# EAGLE design VCLFO_th (EAGLE 7.5.0)
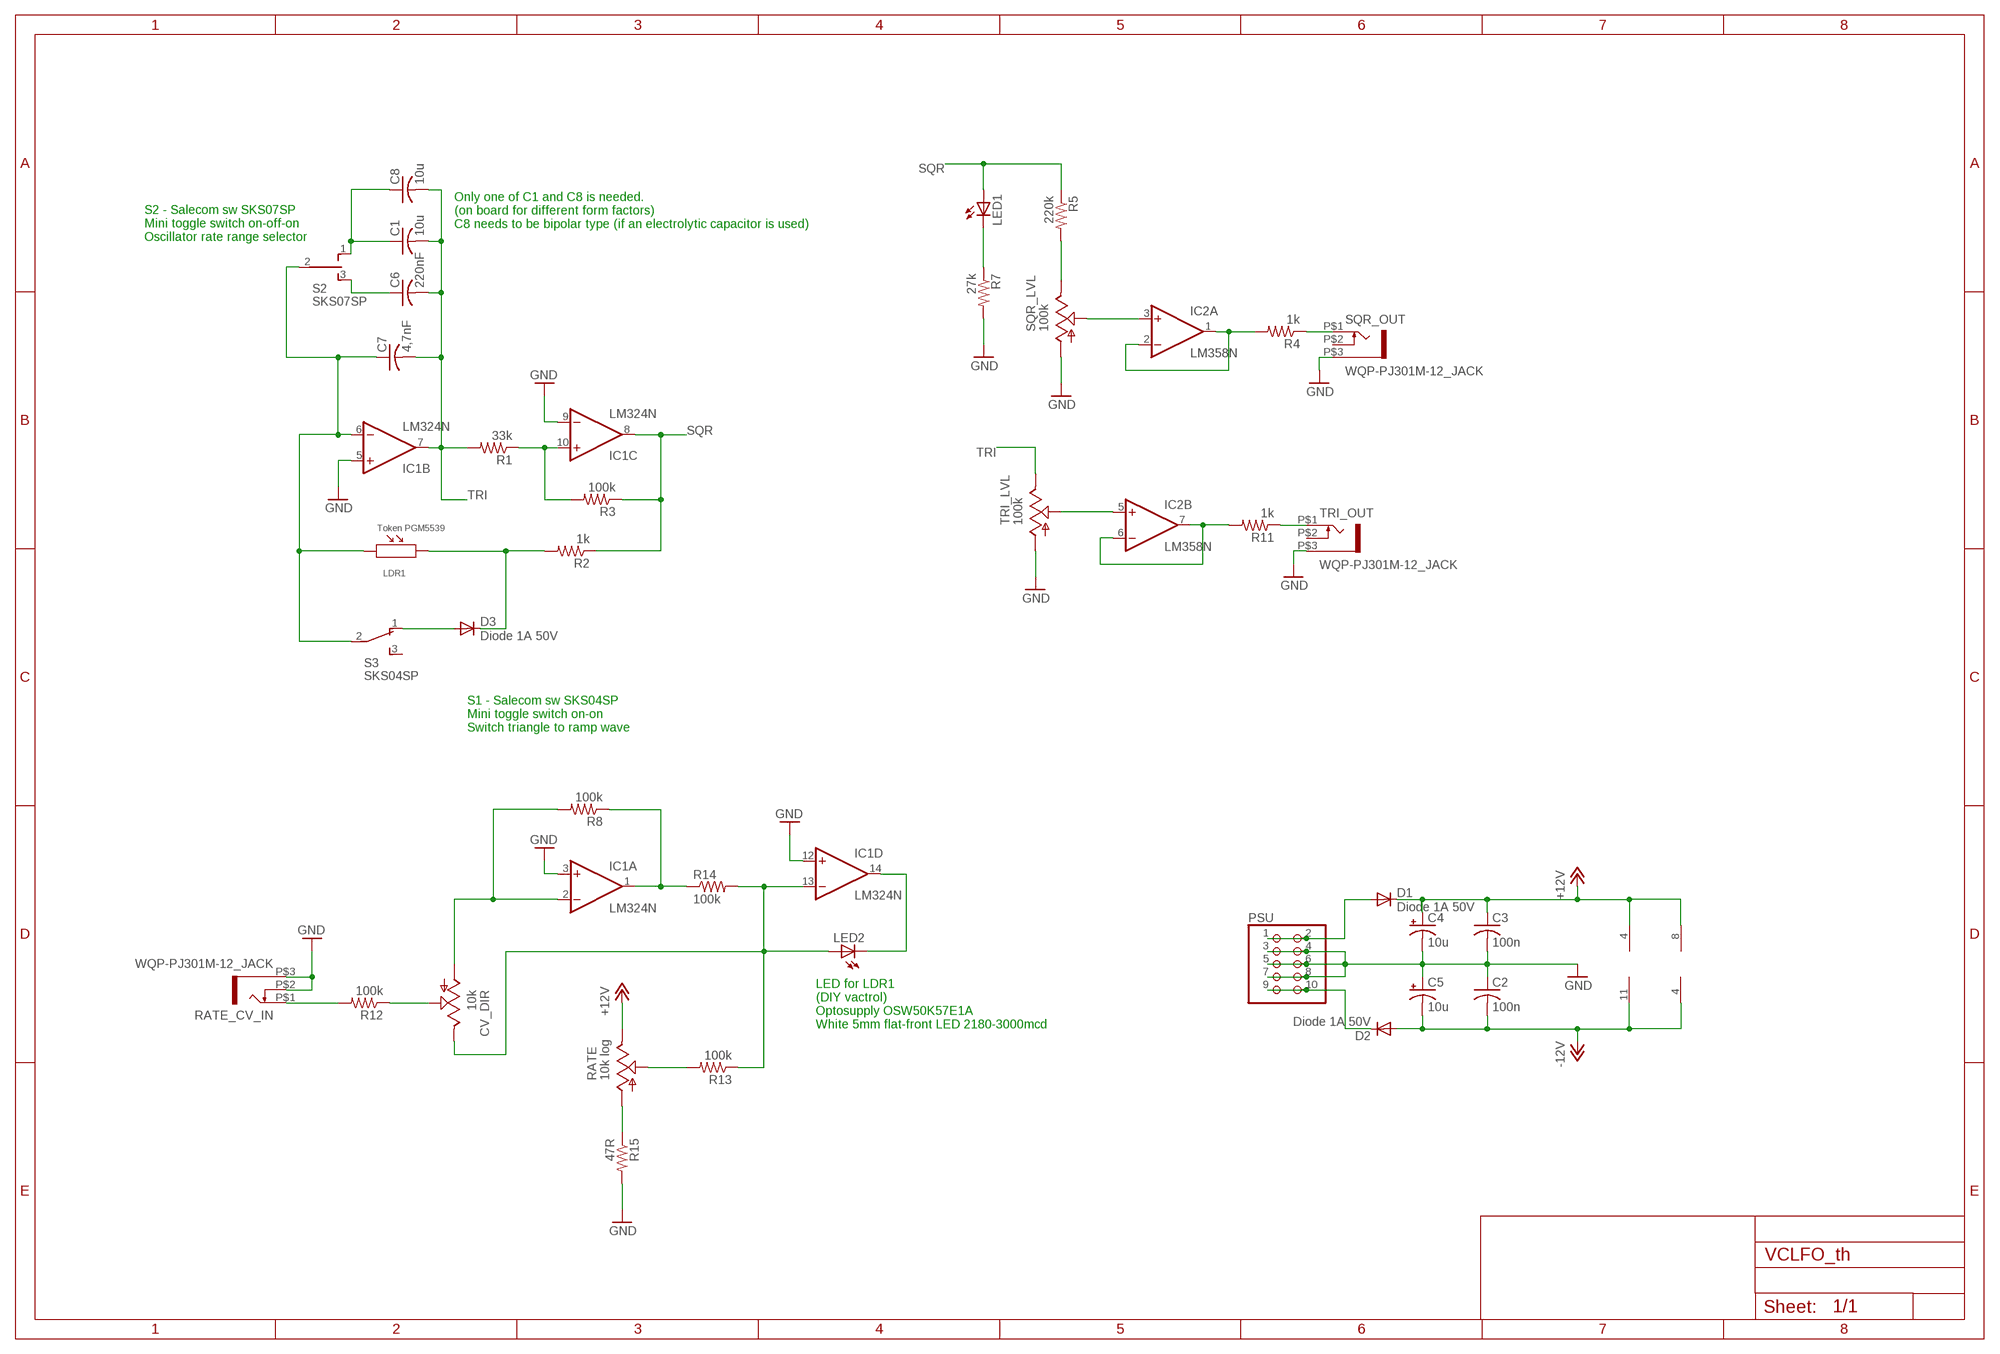
[diagram p0: schematic, sheet 1]

## Parts
C1  10u  C-USC1206  [C1206]
C2  100n  C-US025-025X050  [C025-025X050]
C3  100n  C-US025-025X050  [C025-025X050]
C4  10u  CPOL-USE2.5-6  [E2,5-6]
C5  10u  CPOL-USE2.5-6  [E2,5-6]
C6  220nF  C-US025-025X050  [C025-025X050]
C7  4,7nF  C-US025-025X050  [C025-025X050]
C8  10u  C-US025-050X050  [C025-050X050]
CV_DIR  10k  POT_USVERTICAL  [ALPS_POT_VERTICAL]
D1  Diode 1A 50V  DIODE-D-5  [D-5]
D2  Diode 1A 50V  DIODE-D-5  [D-5]
D3  Diode 1A 50V  DIODE-D-5  [D-5]
IC1  LM324N  [DIL14]
IC2  LM358N  [DIL08]
LDR1  Token PGM5539  LDR_TOKEN_PGM55XX  [LDR_SNR2-3.0]
LED1  LED5MM  [LED5MM]
LED2  LED3MM  [LED3MM]
PSU  PINHD-2X5  [2X05]
R1  33k  R-US_0207/2V  [0207/2V]
R2  1k  R-US_0207/2V  [0207/2V]
R3  100k  R-US_0207/2V  [0207/2V]
R4  1k  R-US_0207/2V  [0207/2V]
R5  220k  R-US_0207/2V  [0207/2V]
R7  27k  R-US_0207/2V  [0207/2V]
R8  100k  R-US_0207/2V  [0207/2V]
R11  1k  R-US_0207/2V  [0207/2V]
R12  100k  R-US_0207/2V  [0207/2V]
R13  100k  R-US_0207/2V  [0207/2V]
R14  100k  R-US_0207/2V  [0207/2V]
R15  47R  R-US_0207/2V  [0207/2V]
RATE  10k log  POT_USVERTICAL  [ALPS_POT_VERTICAL]
RATE_CV_IN  WQP-PJ301M-12_JACK  [WQP-PJ301M-12_JACK]
S2  SKS07SP  TL39PO  [TL3XPO]
S3  SKS04SP  TL36PO  [TL3XPO]
SQR_LVL  100k  POT_USVERTICAL  [ALPS_POT_VERTICAL]
SQR_OUT  WQP-PJ301M-12_JACK  [WQP-PJ301M-12_JACK]
TRI_LVL  100k  POT_USVERTICAL  [ALPS_POT_VERTICAL]
TRI_OUT  WQP-PJ301M-12_JACK  [WQP-PJ301M-12_JACK]

## Nets
+12V: C3.1 C4.+ D1.C IC1.4(P:V+) IC2.8(P:V+) RATE.P$1(E)
-12V: C2.2 C5.- D2.A IC1.11(P:V-) IC2.4(P:V-)
GND: C2.1 C3.2 C4.- C5.+ IC1.3(A:+IN) IC1.5(B:+IN) IC1.9(C:-IN) IC1.12(D:+IN) PSU.3 PSU.4 PSU.5 PSU.6 PSU.7 PSU.8 R7.2 R15.2 RATE_CV_IN.P$2 RATE_CV_IN.P$3 SQR_LVL.P$3(A) SQR_OUT.P$3 TRI_LVL.P$3(A) TRI_OUT.P$3
N$1: C7.1 IC1.6(B:-IN) LDR1.1 S2.2(P) S3.2(P)
N$2: LED1.K(C) R7.1
N$3: IC2.1(A:OUT) IC2.2(A:-IN) R4.2
N$4: R5.2 SQR_LVL.P$1(E)
N$5: IC1.10(C:+IN) R1.1 R3.2
N$6: R4.1 SQR_OUT.P$1
N$7: D3.C LDR1.2 R2.2
N$8: IC2.6(B:-IN) IC2.7(B:OUT) R11.2
N$9: IC2.3(A:+IN) SQR_LVL.P$2(S)
N$10: D1.A PSU.1 PSU.2
N$11: D2.C PSU.9 PSU.10
N$12: R12.2 RATE_CV_IN.P$1
N$14: C1.1 C8.1 S2.1(O)
N$15: CV_DIR.P$2(S) R12.1
N$16: D3.A S3.1(O)
N$17: R11.1 TRI_OUT.P$1
N$19: C6.1 S2.3(S)
N$20: CV_DIR.P$3(A) IC1.2(A:-IN) R8.2
N$21: IC1.14(D:OUT) LED2.K(C)
N$22: IC1.1(A:OUT) R8.1 R14.1
N$23: CV_DIR.P$1(E) IC1.13(D:-IN) LED2.A R13.1 R14.2
N$24: R13.2 RATE.P$2(S)
N$25: R15.1 RATE.P$3(A)
N$28: IC2.5(B:+IN) TRI_LVL.P$2(S)
SQR: IC1.8(C:OUT) LED1.A R2.1 R3.1 R5.1
TRI: C1.2 C6.2 C7.2 C8.2 IC1.7(B:OUT) R1.2 TRI_LVL.P$1(E)
Unconnected: S3.3(S) SQR_OUT.P$2 TRI_OUT.P$2

## Notes on the sheet
- Only one of C1 and C8 is needed. 
  (on board for different form factors)
  C8 needs to be bipolar type (if an electrolytic capacitor is used)
- S2 - Salecom sw SKS07SP
  Mini toggle switch on-off-on
  Oscillator rate range selector
- S1 - Salecom sw SKS04SP
  Mini toggle switch on-on
  Switch triangle to ramp wave
- LED for LDR1
  (DIY vactrol)
  Optosupply OSW50K57E1A
  White 5mm flat-front LED 2180-3000mcd

## Library data of the parts
C1-C3 C6-C8 = rcl:C-US: CAPACITOR, American symbol
C4 C5 = rcl:CPOL-US: POLARIZED CAPACITOR, American symbol
CV_DIR RATE SQR_LVL TRI_LVL = pot-alps:POT_US
D1-D3 = diode:DIODE-: DIODE
IC1 = linear:LM324: OP AMP
IC2 = linear:LM358: OP AMP also LM158; LM258; LM2904 Source: http://cache.national.com/ds/LM/LM158.pdf
LDR1 = lb_devs:LDR_TOKEN_PGM55XX: TOKEN PGM55xx LDR resistors; MPN: PGM55xx; VALUE: PGM55xx
LED1 LED2 = led:LED: LED OSRAM: - CHIPLED LG R971, LG N971, LY N971, LG Q971, LY Q971, LO R971, LY R971 LH N974, LH R974 LS Q976, LO Q976, LY Q976 LO Q996 - Hyper CHIPLED LW Q18S LB Q993, LB Q99A, LB R99A - SideLED LS A670, LO A670, LY A670, LG A670, LP A670 LB A673, LV A673, LT A673, LW A673 LH A674 LY A675 LS A676, LA A676, LO A676, LY A676, LW A676 LS A679, LY A679, LG A679 - Hyper Micro SIDELED® LS Y876, LA Y876, LO Y876, LY Y876 LT Y87S - SmartLED LW L88C, LW L88S LB L89C, LB L89S, LG L890 LS L89K, LO L89K, LY L89K LS L896, LA L896, LO L896, LY L896 - TOPLED LS T670, LO T670, LY T670, LG T670, LP T670 LSG T670, LSP T670, LSY T670, LOP T670, LYG T670 LG T671, LOG T671, LSG T671 LB T673, LV T673, LT T673, LW T673 LH T674 LS T676, LA T676, LO T676, LY T676, LB T676, LH T676, LSB T676, LW T676 LB T67C, LV T67C, LT T67C, LS T67K, LO T67K, LY T67K, LW E67C LS E67B, LA E67B, LO E67B, LY E67B, LB E67C, LV E67C, LT E67C LW T67C LS T679, LY T679, LG T679 LS T770, LO T770, LY T770, LG T770, LP T770 LB T773, LV T773, LT T773, LW T773 LH T774 LS E675, LA E675, LY E675, LS T675 LS T776, LA T776, LO T776, LY T776, LB T776 LHGB T686 LT T68C, LB T68C - Hyper Mini TOPLED® LB M676 - Mini TOPLED Santana® LG M470 LS M47K, LO M47K, LY M47K Source: http://www.osram.convergy.de LUXEON: - LUMILED® LXK2-PW12-R00, LXK2-PW12-S00, LXK2-PW14-U00, LXK2-PW14-V00 LXK2-PM12-R00, LXK2-PM12-S00, LXK2-PM14-U00 LXK2-PE12-Q00, LXK2-PE12-R00, LXK2-PE12-S00, LXK2-PE14-T00, LXK2-PE14-U00 LXK2-PB12-K00, LXK2-PB12-L00, LXK2-PB12-M00, LXK2-PB14-N00, LXK2-PB14-P00, LXK2-PB14-Q00 LXK2-PR12-L00, LXK2-PR12-M00, LXK2-PR14-Q00, LXK2-PR14-R00 LXK2-PD12-Q00, LXK2-PD12-R00, LXK2-PD12-S00 LXK2-PH12-R00, LXK2-PH12-S00 LXK2-PL12-P00, LXK2-PL12-Q00, LXK2-PL12-R00 Source: www.luxeon.com KINGBRIGHT: KA-3528ASYC Source: www.kingbright.com
PSU = pinhead:PINHD-2X5: PIN HEADER
R1-R5 R7 R8 R11-R15 = rcl:R-US_: RESISTOR, American symbol
RATE_CV_IN SQR_OUT TRI_OUT = thonkiconn:WQP-PJ301M-12_JACK
S2 = switch:TL39PO: TINY SWITCH ON OFF ON Source: http://www2.produktinfo.conrad.com/datenblaetter/700000-724999/705152-da-01-de-Subminiaturschalter_TL_36YO.pdf
S3 = switch:TL36PO: TINY SWITCH ON - ON Source: http://www2.produktinfo.conrad.com/datenblaetter/700000-724999/705152-da-01-de-Subminiaturschalter_TL_36YO.pdf

## Board
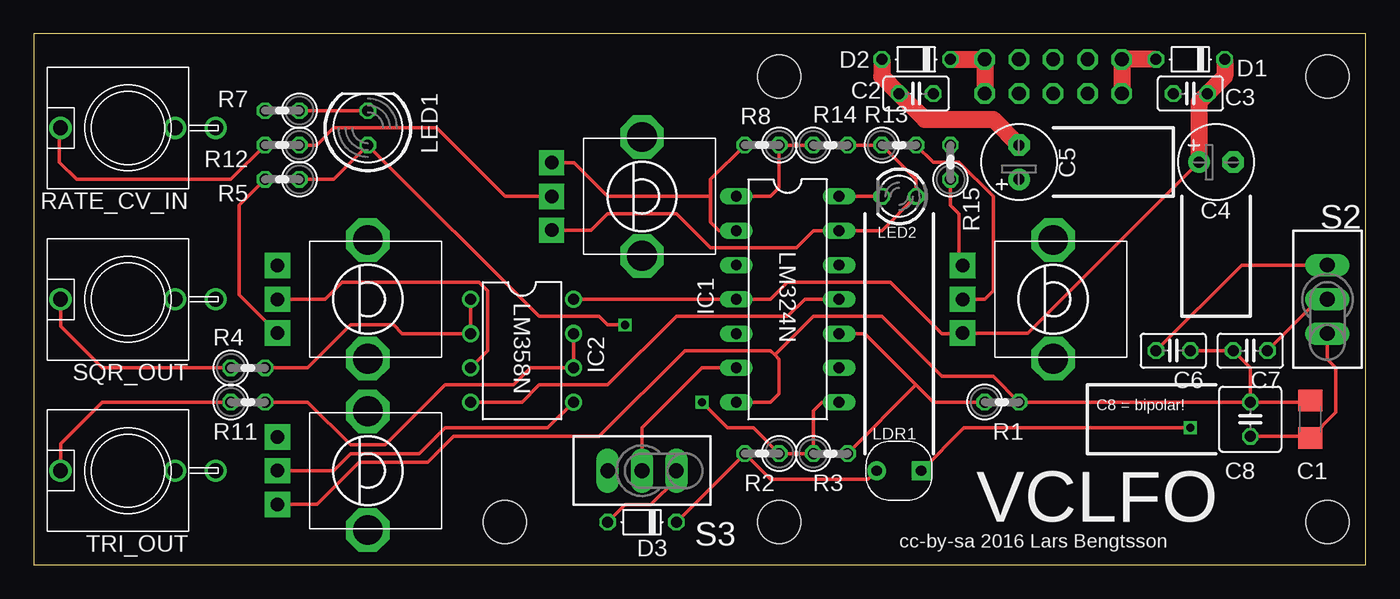
[diagram p1: board, top side]
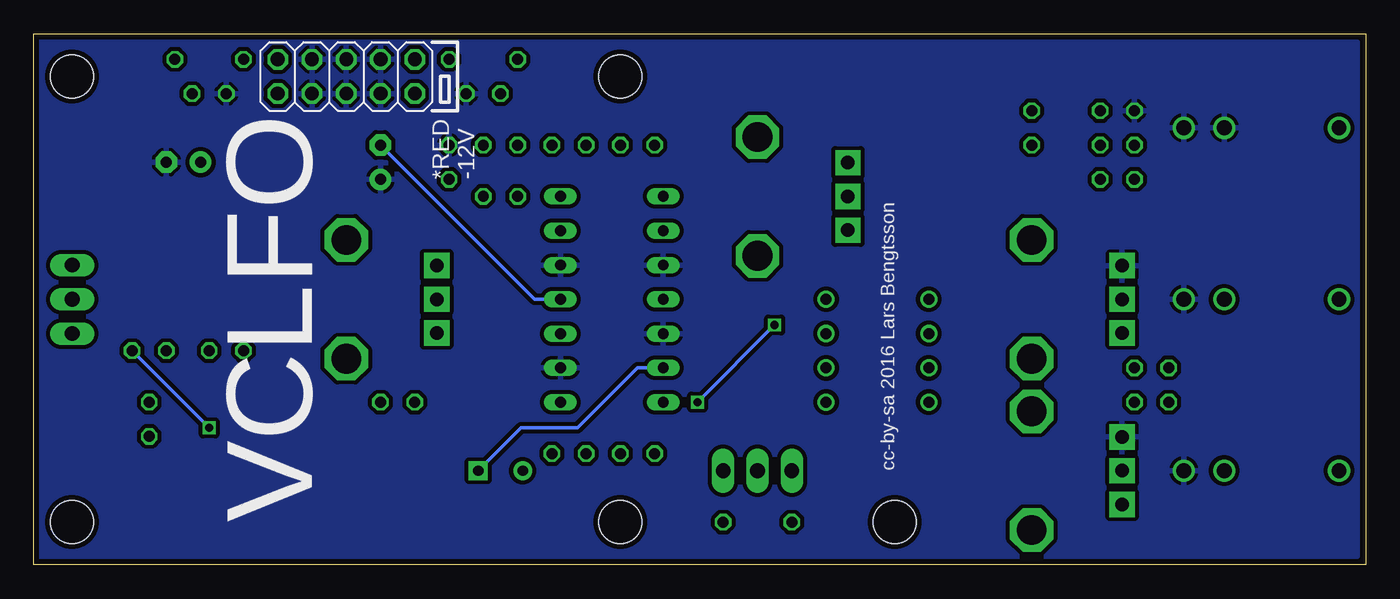
[diagram p2: board, bottom side, seen from below]

Size 98.73 x 39.36 mm. Coordinates in mm from the lower left corner, seen from the top.
Outline: 0,0 98.73,0 98.73,39.36 0,39.36 0,0
Copper layers (1*16): Top 0.0356mm / dielectric 1.5011mm / Bottom 0.0356mm
Design rules "LaenPCBOrder": minimum track width 6mil, minimum drill 13mil, track to track 6mil, track to pad 6mil, pad to pad 6mil, via to via 6mil, smd to smd 6mil, copper to edge 15mil, drill to drill 6mil, minimum pad ring 7mil, minimum via ring 7mil, stop-mask expansion 3mil, vias tented up to drill 0mil, thermal gap 10mil
Holes 3.2 mm at 95.88,36.2 95.88,3.18 55.25,3.18 34.93,3.18 55.25,36.2

### Footprints (pad centres in the part's own frame; a part is rotated, then mirrored left to right if it is on the bottom)
C1206 = smd 1.6 x 1.8: 1 -1.4,0; 2 1.4,0
C025-025X050 = drill 0.813 octagon: 1 -1.27,0; 2 1.27,0
E2,5-6 = drill 0.813 pad 1.6: + -1.27,0 | drill 0.813 pad 1.6 octagon: - 1.27,0
C025-050X050 = drill 0.813 octagon: 1 -1.27,0; 2 1.27,0
ALPS_POT_VERTICAL = drill 1 pad 1.88 square: P$1 -2.5,6.7; P$2 0,6.7; P$3 2.5,6.7 | drill 2.2 pad 3.175 octagon: P$4 -4.4,0; P$5 4.4,0
D-5 = drill 0.813 octagon: A 2.54,0; C -2.54,0
DIL14 = drill 0.813 long: 1 -7.62,-3.81; 2 -5.08,-3.81; 3 -2.54,-3.81; 4 0,-3.81; 5 2.54,-3.81; 6 5.08,-3.81; 7 7.62,-3.81; 8 7.62,3.81; 9 5.08,3.81; 10 2.54,3.81; 11 0,3.81; 12 -2.54,3.81; 13 -5.08,3.81; 14 -7.62,3.81
DIL08 = drill 0.813 pad 1.27: 1 -3.81,-3.81; 2 -1.27,-3.81; 3 1.27,-3.81; 4 3.81,-3.81; 5 3.81,3.81; 6 1.27,3.81; 7 -1.27,3.81; 8 -3.81,3.81
LDR_SNR2-3.0 = drill 0.762 pad 1.397 square: 1 -1.651,0 | drill 0.762 pad 1.397: 2 1.651,0
LED5MM = drill 0.813 octagon: A -1.27,0; K 1.27,0
LED3MM = drill 0.813 octagon: A -1.27,0; K 1.27,0
2X05 = drill 1.016 octagon: 1 -5.08,-1.27; 2 -5.08,1.27; 3 -2.54,-1.27; 4 -2.54,1.27; 5 0,-1.27; 6 0,1.27; 7 2.54,-1.27; 8 2.54,1.27; 9 5.08,-1.27; 10 5.08,1.27
0207/2V = drill 0.813 octagon: 1 -1.27,0; 2 1.27,0
WQP-PJ301M-12_JACK = drill 1.1: P$1 0,5; P$2 0,-3.5; P$3 0,-6.5
TL3XPO = drill 1.1 pad 1.422 long: 1 -2.54,0; 2 0,0; 3 2.54,0

### Placement (x,y rotation side)
C1  94.61,10.8 90 top
C2  65.41,34.93 180 top
C3  85.72,34.93 180 top
C4  87.63,29.84 0 top
C5  73.02,29.84 90 top
C6  84.45,15.88 0 top
C7  90.17,15.88 180 top
C8  90.17,10.8 90 top
CV_DIR  45.09,27.3 90 top
D1  85.72,37.47 180 top
D2  65.41,37.47 180 top
D3  45.09,3.18 180 top
IC1  55.88,19.69 270 top
IC2  36.2,15.88 270 top
LDR1  64.13,6.99 180 top
LED1  24.76,32.39 90 top
LED2  64.13,27.3 180 top
PSU  75.56,36.2 0 bottom
R1  71.75,12.07 0 top
R2  53.98,8.26 180 top
R3  59.05,8.26 0 top
R4  15.88,14.61 0 top
R5  18.41,28.58 180 top
R7  18.41,33.66 180 top
R8  53.98,31.12 180 top
R11  15.88,12.07 0 top
R12  18.41,31.12 180 top
R13  64.13,31.12 0 top
R14  59.05,31.12 0 top
R15  67.94,29.84 90 top
RATE  75.56,19.69 90 top
RATE_CV_IN  6.99,32.39 90 top
S2  95.88,19.69 90 top
S3  45.09,6.99 180 top
SQR_LVL  24.76,19.69 90 top
SQR_OUT  6.99,19.69 90 top
TRI_LVL  24.76,6.99 90 top
TRI_OUT  6.99,6.99 90 top

### Tracks (layer width: path | path; a pad name or v marks a point on that pad's centre or on a via)
+12V
  Top 0.254: IC2.8 IC1.4 54.61,19.69 55.88,20.95 63.5,20.95 67.31,17.15 68.82,17.15 RATE.P$1 73.7,17.19 C4.+
  Top 1.27: D1.C 88.27,36.2 C3.1 86.36,34.29 C4.+
-12V
  Top 0.254: IC2.4 36.2,12.07 37.47,13.34 42.55,13.34 47.62,18.41 55.88,18.41 57.15,19.69 IC1.11
  Top 1.27: D2.A 62.87,36.2 C2.2 66.04,33.02 71.12,33.02 C5.-
  Bottom 0.254: IC1.11 61.59,19.69 C5.-
GND
  pour Bottom (isolate 0.305): 0.64,38.73 98.42,38.73 98.42,0.64 0.64,0.64
N$1  (via drill 0.6)
  Top 0.254: IC1.6 49.53,14.61 45.09,10.16 S3.2 | C7.1 95.25,19.69 S2.2 | v85.72,10.16 68.96,10.16 LDR1.1
  Bottom 0.254: IC1.6 53.98,14.61 58.42,10.16 62.61,10.16 LDR1.1 | C7.1 v85.72,10.16
N$2
  Top 0.254: R7.1 LED1.K
N$3
  Top 0.254: IC2.1 IC2.2 27.3,17.15 26.67,17.78 23.49,17.78 20.32,14.61 R4.2
N$4
  Top 0.254: R5.2 15.24,26.67 15.24,20.01 SQR_LVL.P$1
N$5
  Top 0.254: IC1.10 61.59,17.15 65.41,13.34 | 65.41,13.34 66.67,12.07 R1.1 | R3.2 65.41,13.34
N$6
  Top 0.254: SQR_OUT.P$1 1.99,17.7 5.08,14.61 R4.1
N$7
  Top 0.254: D3.C R2.2 54.61,6.35 61.85,6.35 LDR1.2
N$8
  Top 0.254: IC2.7 IC2.6 36.83,14.61 35.56,13.34 30.48,13.34 26.04,8.89 23.49,8.89 20.32,12.07 R11.2
N$9
  Top 0.254: IC2.3 33.66,15.88 33.66,20.32 33.02,20.95 22.86,20.95 21.59,19.69 SQR_LVL.P$2
N$10
  Top 1.27: PSU.1 PSU.2 D1.A
N$11
  Top 1.27: PSU.9 PSU.10 D2.C
N$12
  Top 0.254: R12.2 14.61,28.58 3.17,28.58 1.91,29.84 1.91,32.3 RATE_CV_IN.P$1
N$14
  Top 0.254: S2.1 95.88,15.24 96.52,14.61 96.52,11.3 C1.1 94.48,9.53 C8.1
N$15
  Top 0.254: R12.1 20.95,31.12 22.22,32.39 29.84,32.39 34.93,27.3 CV_DIR.P$2
N$16
  Top 0.254: S3.1 47.62,6.35 45.72,4.45 43.82,4.45 D3.A
N$17
  Top 0.254: TRI_OUT.P$1 1.99,8.97 5.08,12.07 R11.1
N$19
  Top 0.254: S2.3 89.53,22.23 C6.1
N$20
  Top 0.254: IC1.2 50.8,24.77 50.16,25.4 50.16,27.3 | 50.16,27.3 50.16,28.58 R8.2 | CV_DIR.P$3 40.05,29.8 42.55,27.3 50.16,27.3
N$21
  Top 0.254: LED2.K IC1.14
N$22
  Top 0.254: R14.1 R8.1 55.25,27.94 54.61,27.3 IC1.1
N$23
  Top 0.254: CV_DIR.P$1 41.32,24.8 42.55,26.04 47.62,26.04 50.16,23.5 56.52,23.5 57.79,24.77 IC1.13 62.87,24.77 LED2.A 65.41,28.58 R13.1 R14.2
N$24
  Top 0.254: RATE.P$2 70.48,19.69 71.12,20.32 71.12,27.3 68.58,29.84 66.67,29.84 R13.2
N$25
  Top 0.254: R15.1 67.94,26.67 68.58,26.04 68.58,22.47 RATE.P$3
N$28
  Top 0.254: TRI_LVL.P$2 22.22,6.99 23.49,8.26 28.57,8.26 30.48,10.16 38.1,10.16 IC2.5
SQR  (via drill 0.6)
  Top 0.254: R5.1 22.22,28.58 LED1.A 37.47,18.41 41.91,18.41 42.55,17.78 v43.82,17.78 | IC1.8 58.42,12.07 57.79,11.43 R3.1 R2.1 53.34,10.16 51.44,10.16 v49.53,12.07
  Bottom 0.254: v49.53,12.07 v43.82,17.78
TRI
  Top 0.254: TRI_LVL.P$1 20.99,4.49 24.13,7.62 29.21,7.62 31.11,9.53 41.91,9.53 48.26,15.88 54.61,15.88 54.93,15.56 | 54.93,15.56 55.25,15.24 55.25,12.7 54.61,12.07 IC1.7 | 54.93,15.56 57.79,18.41 62.87,18.41 67.31,13.97 71.12,13.97 R1.2 C8.2 | C8.2 94.48,12.07 C1.2 | C6.2 C7.2 90.17,14.61 C8.2

### Text on the board
tPlace: C8 = bipolar! | VCLFO | cc-by-sa 2016 Lars Bengtsson
bPlace: *RED / -12V | cc-by-sa 2016 Lars Bengtsson | VCLFO